# EAGLE schematic hub75-Adapter mkii (EAGLE 9.6.0)
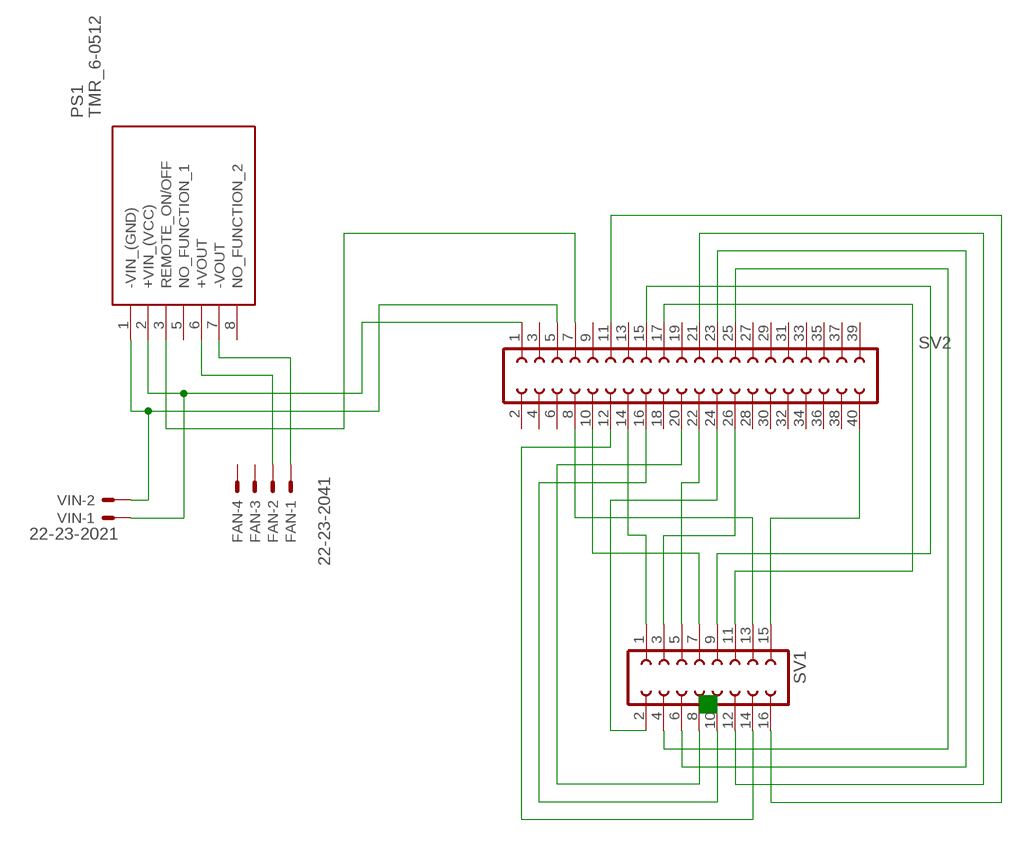
[diagram p0: schematic, sheet 1]

## Parts
FAN  22-23-2041  [22-23-2041]
PS1  TMR_6-0512  [TMR-6]
SV1  FE08-2  [FE08-2]
SV2  FE20-2  [FE20-2]
VIN  22-23-2021  [22-23-2021]

## Nets
N$1: SV1.1 SV2.14
N$2: SV1.3 SV2.26
N$3: SV1.5 SV2.22
N$4: SV1.7 SV2.10
N$5: SV1.9 SV2.15
N$6: SV1.11 SV2.17
N$7: SV1.13 SV2.8
N$8: SV1.15 SV2.40
N$9: SV1.2 SV2.24
N$10: SV1.4 SV2.25
N$11: SV1.6 SV2.23
N$12: SV1.8 SV2.20
N$13: SV1.10 SV2.16
N$14: PS1.3(REMOTE_ON/OFF) SV2.7
N$15: SV1.12 SV2.21
N$16: SV1.14 SV2.12
N$17: PS1.2(+VIN_(VCC)) SV2.1 VIN.1
N$18: FAN.1 PS1.7(-VOUT)
N$19: SV1.16 SV2.11
N$20: FAN.2 PS1.6(+VOUT)
N$21: PS1.1(-VIN_(GND)) SV2.5 VIN.2
Unconnected: FAN.3 FAN.4 PS1.5(NO_FUNCTION_1) PS1.8(NO_FUNCTION_2) SV2.2 SV2.3 SV2.4 SV2.6 SV2.9 SV2.13 SV2.18 SV2.19 SV2.27 SV2.28 SV2.29 SV2.30 SV2.31 SV2.32 SV2.33 SV2.34 SV2.35 SV2.36 SV2.37 SV2.38 SV2.39

## Library data of the parts
FAN = con-molex:22-23-2041: .100" (2.54mm) Center Header - 4 Pin; MF: MOLEX; MPN: 22-23-2041; OC_FARNELL: 1462920; OC_NEWARK: 38C0355
PS1 = TMR_6-0512:TMR_6-0512: 6 Watt DC/DC converter, industrial, 2:1 input, regulated, 1600 VDC I/O-isolation, encapsulated, SIP-8 Source: Datasheet <https://tracopower.com/tmr6-datasheet/>; DESCRIPTION: 6 Watt DC/DC converter, industrial, 2:1 input, regulated, 1600 VDC I/O-isolation, encapsulated, SIP-8; HEIGHT: mm; MANUFACTURER_NAME: Traco Power; MANUFACTURER_PART_NUMBER: TMR 6-0512; MOUSER_PART_NUMBER: 495-TMR-6-0512; MOUSER_PRICE-STOCK: https://www.mouser.co.uk/ProductDetail/TRACO-Power/TMR-6-0512/?qs=ckJk83FOD0Xq8aDSZctxXw%3D%3D
SV1 = con-lsta:FE08-2: FEMALE HEADER; OC_FARNELL: unknown; OC_NEWARK: unknown
SV2 = con-lsta:FE20-2: FEMALE HEADER; OC_FARNELL: unknown; OC_NEWARK: unknown
VIN = con-molex:22-23-2021: .100" (2.54mm) Center Header - 2 Pin; MF: MOLEX; MPN: 22-23-2021; OC_FARNELL: 1462926; OC_NEWARK: 25C3832